# Altium project PCB_Project.PrjPcb
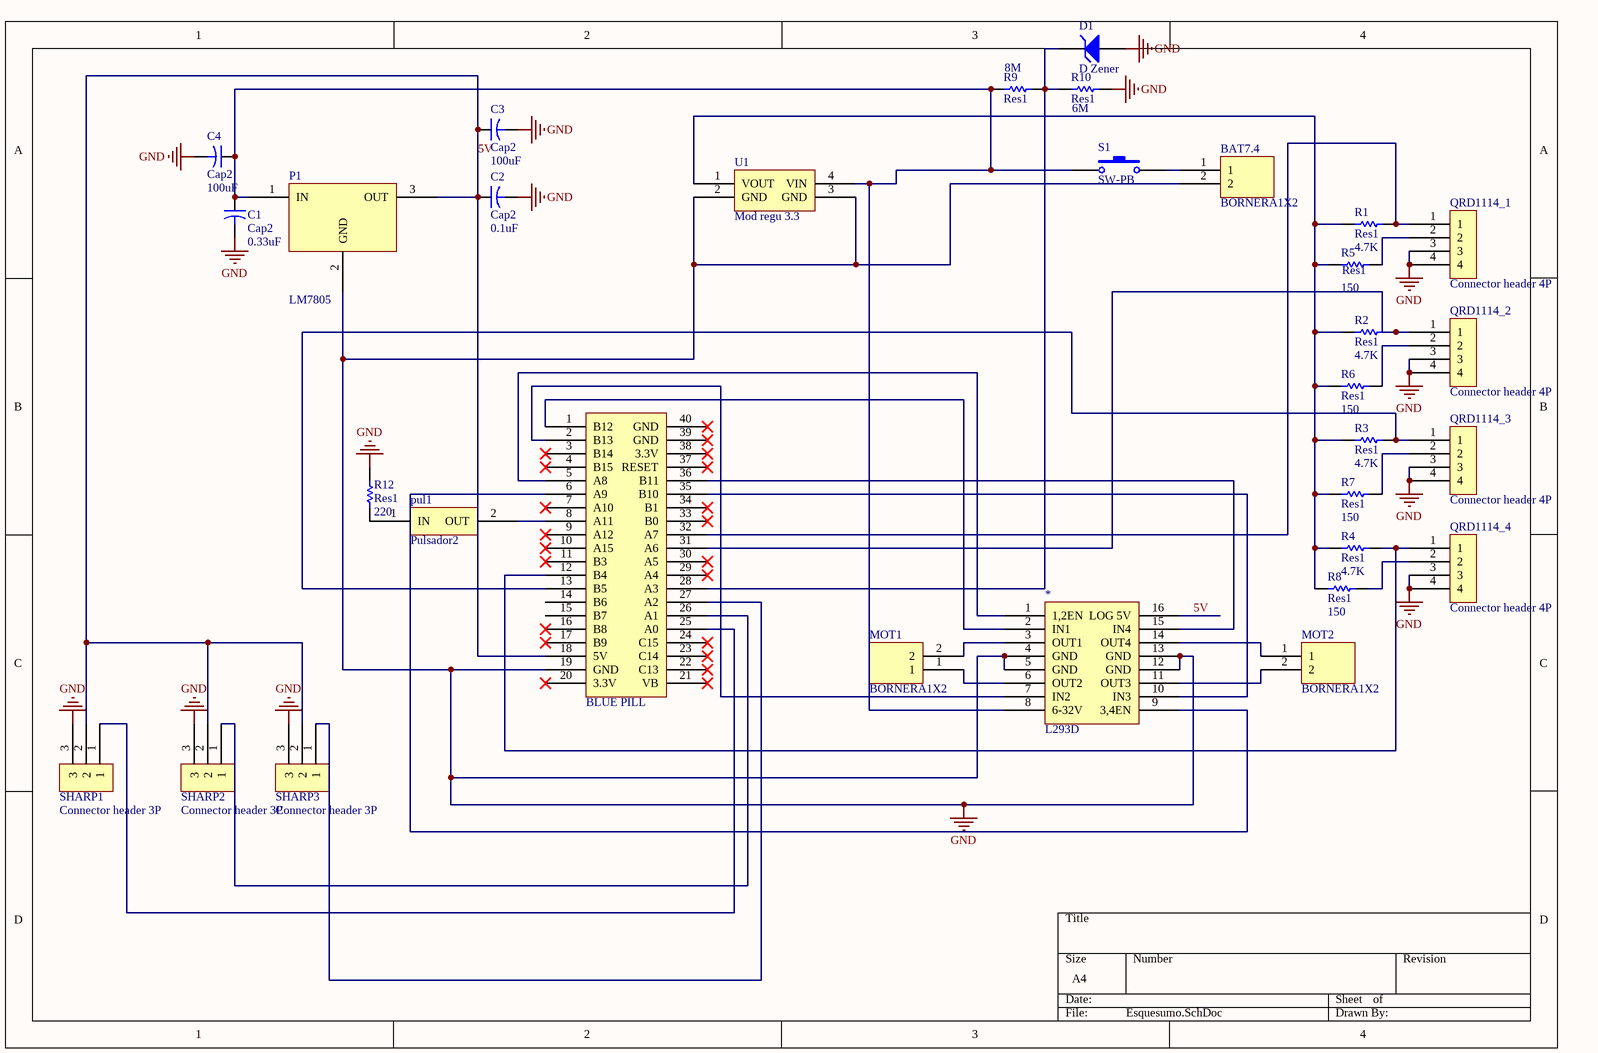
[diagram p0: Esquesumo.SchDoc]
1 sheet, 32 parts. Net scope: global (net labels, ports and power ports of the same name join across sheets).
Board file: pcbsumo.PcbDoc

## Sheet Esquesumo.SchDoc
size A4

### Parts
*  L293D  [DIP16]
BAT7.4  BORNERA1X2  [BORN1X2]
C1  Cap2  value 0.33uF  [CAPR5-4X5]
C2  Cap2  value 0.1uF  [CAPR5-4X5]
C3  Cap2  value 100uF  [CAPR5-4X5]
C4  Cap2  value 100uF  [CAPR5-4X5]
D1  D Zener  [DIODE-0.7]
MOT1  BORNERA1X2  [BORN1X2]
MOT2  BORNERA1X2  [BORN1X2]
P1  LM7805  [TO-220A]
pul1  Pulsador2  [PULSADOR]
QRD1114_1  Connector header 4P  [HEADER 1X4]
QRD1114_2  Connector header 4P  [HEADER 1X4]
QRD1114_3  Connector header 4P  [HEADER 1X4]
QRD1114_4  Connector header 4P  [HEADER 1X4]
R1  Res1  value 4.7K  [AXIAL-0.3]
R2  Res1  value 4.7K  [AXIAL-0.3]
R3  Res1  value 4.7K  [AXIAL-0.3]
R4  Res1  value 4.7K  [AXIAL-0.3]
R5  Res1  value 150  [AXIAL-0.3]
R6  Res1  value 150  [AXIAL-0.3]
R7  Res1  value 150  [AXIAL-0.3]
R8  Res1  value 150  [AXIAL-0.3]
R9  Res1  value 8M  [AXIAL-0.3]
R10  Res1  value 6M  [AXIAL-0.3]
R12  Res1  value 220  [AXIAL-0.3]
S1  SW-PB  [SPST-2]
SHARP1  Connector header 3P  [HEADER 1X3]
SHARP2  Connector header 3P  [HEADER 1X3]
SHARP3  Connector header 3P  [HEADER 1X3]
U1  Mod regu 3.3  [ASM1117]
  BLUE PILL  [DIP40]

### Nets
GND: *.4(GND) *.5(GND) *.12(GND) *.13(GND) BAT7.4.2 C1.2 C2.2 C3.2 C4.2 D1.1(A) P1.2(GND) QRD1114_1.3 QRD1114_1.4 QRD1114_2.3 QRD1114_2.4 QRD1114_3.3 QRD1114_3.4 QRD1114_4.3 QRD1114_4.4 R10.2 R12.2 SHARP1.3 SHARP2.3 SHARP3.3 U1.2(GND) U1.3(GND) .19(GND)
5V: *.16(LOG_5V) C2.1 C3.1 P1.3(OUT) SHARP1.2 SHARP2.2 SHARP3.2 .18(5V)
Net*_1: *.1(1,2EN) .5(A8)
Net*_2: *.2(IN1) .1(B12)
Net*_3: *.3(OUT1) MOT1.2
Net*_6: *.6(OUT2) MOT1.1
Net*_7: *.7(IN2) .2(B13)
Net*_8: *.8(6-32V) C1.1 C4.1 P1.1(IN) R9.1 S1.1 U1.4(VIN)
Net*_9: *.9(3,4EN) .6(A9)
Net*_10: *.10(IN3) .35(B10)
Net*_11: *.11(OUT3) MOT2.2
Net*_14: *.14(OUT4) MOT2.1
Net*_15: *.15(IN4) .36(B11)
NetBAT7.4_1: BAT7.4.1 S1.2
NetD1_2: D1.2(K) R9.2 R10.1 .28(A3)
Netpul1_1: pul1.1(IN) R12.1
Netpul1_2: pul1.2(OUT) .8(A11)
NetQRD1114_1_1: QRD1114_1.1 R1.2 .32(A7)
NetQRD1114_1_2: QRD1114_1.2 R5.2
NetQRD1114_2_1: QRD1114_2.1 R2.2 .31(A6)
NetQRD1114_2_2: QRD1114_2.2 R6.2
NetQRD1114_3_1: QRD1114_3.1 R3.2 .13(B5)
NetQRD1114_3_2: QRD1114_3.2 R7.2
NetQRD1114_4_1: QRD1114_4.1 R4.2 .12(B4)
NetQRD1114_4_2: QRD1114_4.2 R8.2
NetR1_1: R1.1 R2.1 R3.1 R4.1 R5.1 R6.1 R7.1 R8.1 U1.1(VOUT)
NetSHARP1_1: SHARP1.1 .25(A0)
NetSHARP2_1: SHARP2.1 .26(A1)
NetSHARP3_1: SHARP3.1 .27(A2)

Not connected (* = marked no-connect by the designer):  3(B14)* 4(B15)* 7(A10)* 9(A12)* 10(A15)* 11(B3)* 14(B6) 15(B7) 16(B8)* 17(B9)* 20(3.3V)* 21(VB)* 22(C13)* 23(C14)* 24(C15)* 29(A4)* 30(A5)* 33(B0)* 34(B1)* 37(RESET)* 38(3.3V)* 39(GND)* 40(GND)*

### Library data of the parts
* = L293D: TB6612FNG
BAT7.4 MOT1 MOT2 = BORNERA1X2: Optoacoplador con fototransistor de salida y conexión a base. Voltaje de aislamiento de prueba 5300 VRMS, capacitancia entrada -salida < 0.5 pF. Empaque 6-DIP.
C1-C4 = Cap2: Capacitor; Published: 23-Sep-2002; PackageReference: CAPR5-4X5; Publisher: Altium Limited; PackageDescription: Capacitor; 2 Leads
D1 = D Zener: Zener Diode; Published: 8-Jun-2000; LatestRevisionDate: 17-Jul-2002; LatestRevisionNote: Re-released for DXP Platform.; PackageReference: DIODE-0.7; Publisher: Altium Limited; PackageDescription: Diode, Thru-Hole; 2 Leads; 0.7 in Pin Spacing
P1 = LM7805: D39 IC REGULATOR 5VOLT LM7805 THT
QRD1114_1-QRD1114_4 = Connector header 4P: Header, 4-Pin
R1-R10 R12 = Res1: Resistor; Published: 8-Jun-2000; LatestRevisionDate: 17-Jul-2002; LatestRevisionNote: Re-released for DXP Platform.; PackageReference: AXIAL-0.3; Publisher: Altium Limited; PackageDescription: Axial Device, Thru-Hole; 2 Leads; 0.3 in Pin Spacing
S1 = SW-PB: Switch; Published: 24-Mar-1999; LatestRevisionDate: 17-Jul-2002; LatestRevisionNote: Re-released for DXP Platform.; PackageReference: SPST-2; Publisher: Altium Limited; PackageDescription: Switch; 2 Leads
SHARP1-SHARP3 = Connector header 3P: Header, 3-Pin
U1 = ASM1117: Optoacoplador con fototransistor de salida y conexión a base. Voltaje de aislamiento de prueba 5300 VRMS, capacitancia entrada -salida < 0.5 pF. Empaque 6-DIP.
 = BLUE PILL: DIP20 STM32F103C8T6